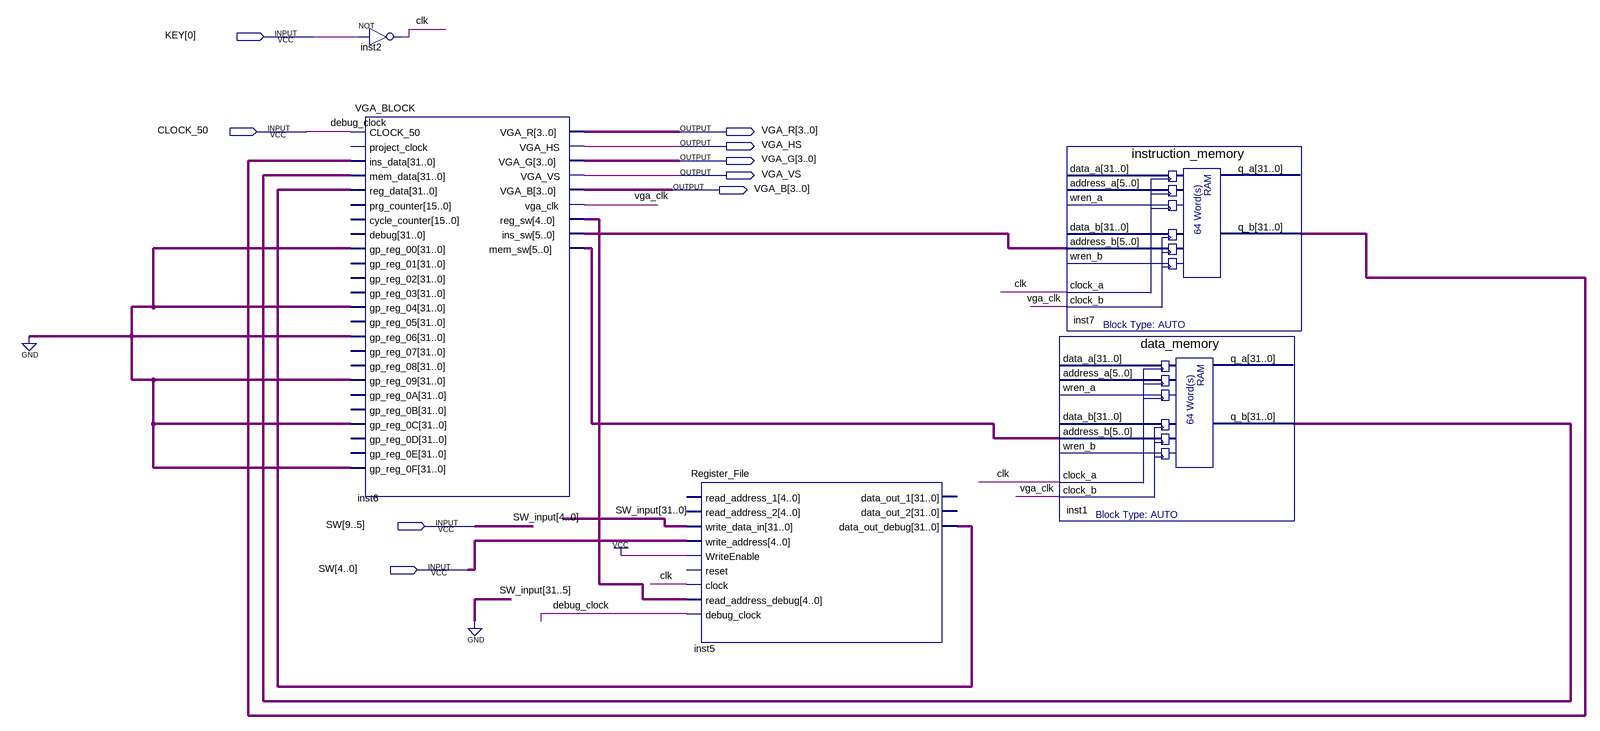
[diagram p0: schematic sheet]
// Quartus schematic Register_File_and_Memory.bdf as structural Verilog: 5 symbols, 9 pins
module Register_File_and_Memory (
  input  [0:0] KEY,
  input  CLOCK_50,
  input  [9:0] SW,
  output [3:0] VGA_R,
  output VGA_HS,
  output [3:0] VGA_G,
  output VGA_VS,
  output [3:0] VGA_B
);

  wire clk, vga_clk;
  wire [4:0] inst6_reg_sw;
  wire [5:0] inst6_ins_sw, inst6_mem_sw;
  wire [31:0] inst1_q_b, inst5_data_out_debug, inst7_q_b;

  not inst2 (clk, KEY[0]);
  VGA_BLOCK inst6 (
    .CLOCK_50(CLOCK_50), .ins_data(inst7_q_b), .mem_data(inst1_q_b), .reg_data(inst5_data_out_debug),
    .gp_reg_00({32{1'b0}}), .gp_reg_04({32{1'b0}}), .gp_reg_06({32{1'b0}}), .gp_reg_09({32{1'b0}}),
    .gp_reg_0C({32{1'b0}}), .gp_reg_0F({32{1'b0}}), .VGA_R(VGA_R), .VGA_HS(VGA_HS), .VGA_G(VGA_G),
    .VGA_VS(VGA_VS), .VGA_B(VGA_B), .vga_clk(vga_clk), .reg_sw(inst6_reg_sw), .ins_sw(inst6_ins_sw),
    .mem_sw(inst6_mem_sw));  // open: project_clock, prg_counter, cycle_counter, debug, gp_reg_01, gp_reg_02, gp_reg_03, gp_reg_05, gp_reg_07, gp_reg_08, gp_reg_0A, gp_reg_0B, gp_reg_0D, gp_reg_0E
  Register_File inst5 (
    .write_data_in({{27{1'b0}}, SW[9:5]}), .write_address(SW[4:0]), .WriteEnable(1'b1), .clock(clk),
    .read_address_debug(inst6_reg_sw), .debug_clock(CLOCK_50), .data_out_debug(inst5_data_out_debug));  // open: read_address_1, read_address_2, reset, data_out_1, data_out_2
  instruction_memory inst7 (
    .address_b(inst6_ins_sw), .clock_a(clk), .clock_b(vga_clk), .q_b(inst7_q_b));  // open: data_a, address_a, wren_a, data_b, wren_b, q_a
  data_memory inst1 (
    .address_b(inst6_mem_sw), .clock_a(clk), .clock_b(vga_clk), .q_b(inst1_q_b));  // open: data_a, address_a, wren_a, data_b, wren_b, q_a

  // Other names for the same wires on the sheet: debug_clock = CLOCK_50; SW_input[4:0] = SW[9:5]
endmodule
